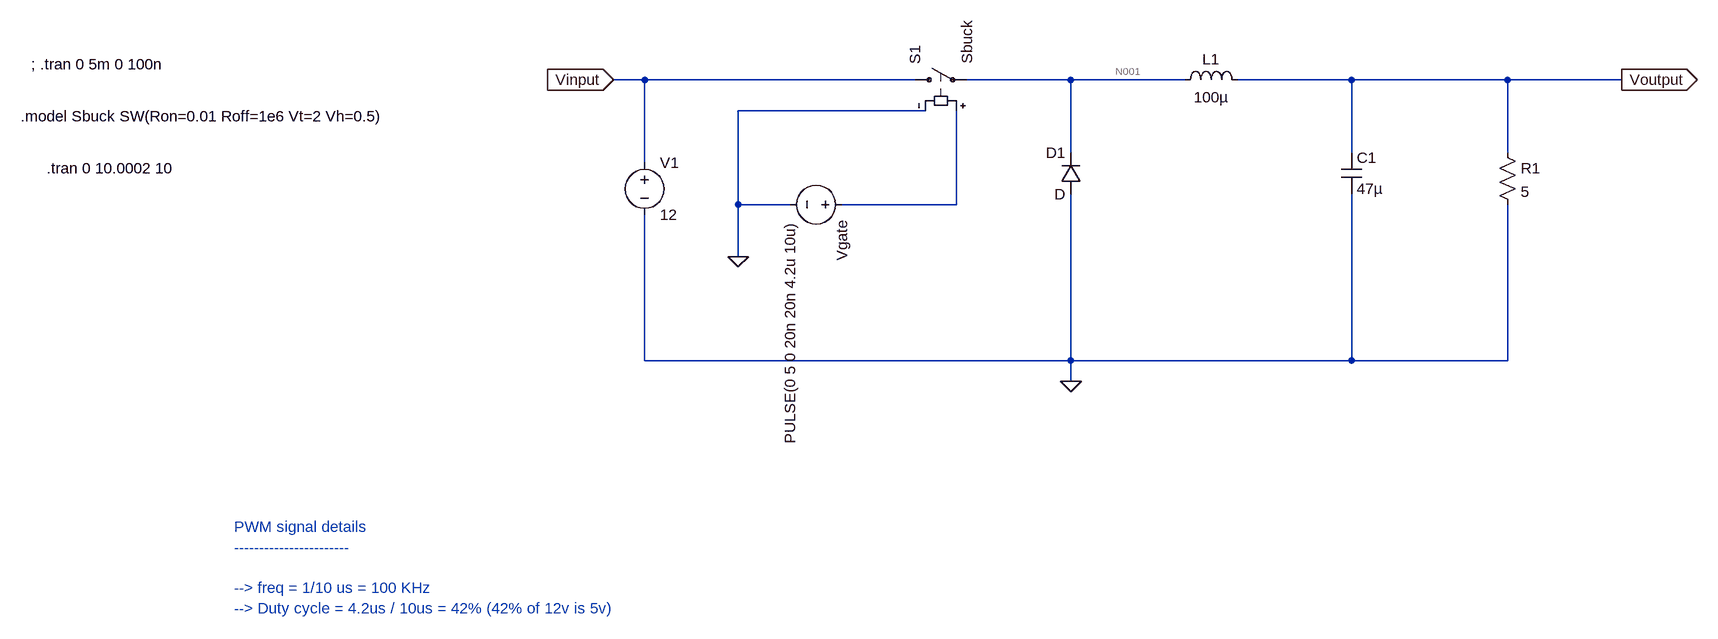
[diagram p0: schematic Buck_converter.asc]
Buck_converter.asc, the LTspice schematic file:
Version 4.1
SHEET 1 1464 816
WIRE -192 0 -240 0
WIRE 224 0 -192 0
WIRE 464 0 304 0
WIRE 640 0 464 0
WIRE 896 0 720 0
WIRE 1136 0 896 0
WIRE 1312 0 1136 0
WIRE 240 48 -48 48
WIRE 464 112 464 0
WIRE 896 112 896 0
WIRE 1136 112 1136 0
WIRE -192 128 -192 0
WIRE -48 192 -48 48
WIRE 32 192 -48 192
WIRE 288 192 288 48
WIRE 288 192 112 192
WIRE -48 272 -48 192
WIRE -192 432 -192 208
WIRE 464 432 464 176
WIRE 464 432 -192 432
WIRE 896 432 896 176
WIRE 896 432 464 432
WIRE 1136 432 1136 192
WIRE 1136 432 896 432
WIRE 464 464 464 432
FLAG 464 464 0
FLAG 1312 0 Voutput
IOPIN 1312 0 Out
FLAG -240 0 Vinput
IOPIN -240 0 In
FLAG -48 272 0
SYMBOL voltage -192 112 R0
WINDOW 123 0 0 Left 0
WINDOW 39 0 0 Left 0
SYMATTR InstName V1
SYMATTR Value 12
SYMBOL sw 208 0 R270
SYMATTR InstName S1
SYMATTR Value Sbuck
SYMBOL diode 480 176 R180
WINDOW 0 24 64 Left 2
WINDOW 3 24 0 Left 2
SYMATTR InstName D1
SYMBOL ind 624 16 R270
WINDOW 0 32 56 VTop 2
WINDOW 3 5 56 VBottom 2
SYMATTR InstName L1
SYMATTR Value 100µ
SYMBOL cap 880 112 R0
SYMATTR InstName C1
SYMATTR Value 47µ
SYMBOL res 1120 96 R0
SYMATTR InstName R1
SYMATTR Value 5
SYMBOL voltage 128 192 R90
WINDOW 123 0 0 Left 0
WINDOW 39 0 0 Left 0
SYMATTR InstName Vgate
SYMATTR Value PULSE(0 5 0 20n 20n 4.2u 10u)
TEXT -824 688 Left 2 ;PWM signal details\n-----------------------\n \n--> freq = 1/10 us = 100 KHz\n--> Duty cycle = 4.2us / 10us = 42% (42% of 12v is 5v)
TEXT -1152 56 Left 2 !.model Sbuck SW(Ron=0.01 Roff=1e6 Vt=2 Vh=0.5)
TEXT -1136 -24 Left 2 !; .tran 0 5m 0 100n
TEXT -1112 136 Left 2 !.tran 0 10.0002 10

The netlist it stands for:
* Buck_converter.asc
V1 Vinput 0 12
S1 Vinput N001 N002 0 Sbuck
D1 0 N001 D
L1 N001 Voutput 100µ
C1 Voutput 0 47µ
R1 Voutput 0 5
Vgate N002 0 PULSE(0 5 0 20n 20n 4.2u 10u)
.model D D
.lib standard.dio
* PWM signal details
* -----------------------
* --> freq = 1/10 us = 100 KHz
* --> Duty cycle = 4.2us / 10us = 42% (42% of 12v is 5v)
.model Sbuck SW(Ron=0.01 Roff=1e6 Vt=2 Vh=0.5)
; .tran 0 5m 0 100n
.tran 0 10.0002 10
.backanno
.end

* Results of the author's LTspice run, read from the files saved beside the schematic
* Operating Point, zero values left out:
*   V(n001) = 60.01 µV
*   V(voutput) = 60 µV
*   V(vinput) = 12 V
*   I(V1) = -12 µA
*   I(R1) = 12 µA
*   I(S1) = -12 µA
*   I(L1) = 12 µA